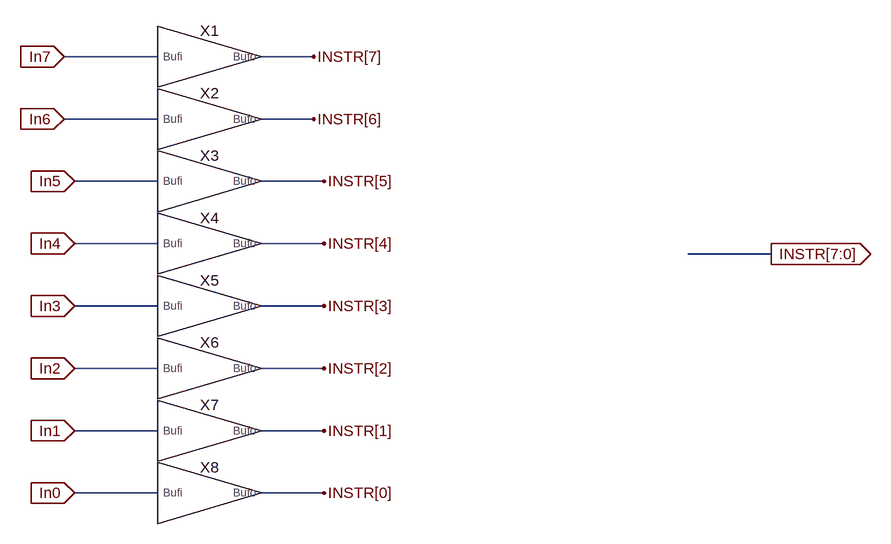
[diagram p0: schematic Combine8.asc]
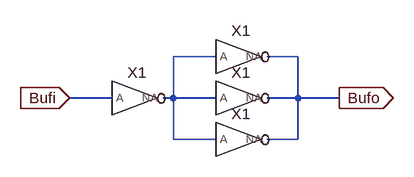
[diagram p1: sub-circuit buffer.asc]
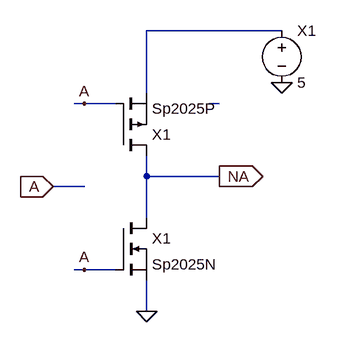
[diagram p2: sub-circuit invert.asc]
Combine8.asc, the LTspice schematic file:
Version 4.1.1
SHEET 1 1152 872
WIRE 16 128 -128 128
WIRE 256 128 176 128
WIRE 16 224 -128 224
WIRE 256 224 176 224
WIRE 16 320 -112 320
WIRE 272 320 176 320
WIRE 16 416 -112 416
WIRE 272 416 176 416
WIRE 960 432 832 432
WIRE 16 512 -112 512
WIRE 272 512 176 512
WIRE 16 608 -112 608
WIRE 272 608 176 608
WIRE 16 704 -112 704
WIRE 272 704 176 704
WIRE 16 800 -112 800
WIRE 272 800 176 800
FLAG 960 432 INSTR[7:0]
IOPIN 960 432 Out
FLAG 256 128 INSTR[7]
FLAG 256 224 INSTR[6]
FLAG 272 320 INSTR[5]
FLAG 272 416 INSTR[4]
FLAG 272 512 INSTR[3]
FLAG 272 608 INSTR[2]
FLAG 272 704 INSTR[1]
FLAG 272 800 INSTR[0]
FLAG -128 128 In7
IOPIN -128 128 In
FLAG -128 224 In6
IOPIN -128 224 In
FLAG -112 320 In5
IOPIN -112 320 In
FLAG -112 416 In4
IOPIN -112 416 In
FLAG -112 512 In3
IOPIN -112 512 In
FLAG -112 608 In2
IOPIN -112 608 In
FLAG -112 704 In1
IOPIN -112 704 In
FLAG -112 800 In0
IOPIN -112 800 In
SYMBOL Buffer 96 128 R0
SYMATTR InstName X1
SYMBOL Buffer 96 224 R0
SYMATTR InstName X2
SYMBOL Buffer 96 320 R0
SYMATTR InstName X3
SYMBOL Buffer 96 416 R0
SYMATTR InstName X4
SYMBOL Buffer 96 512 R0
SYMATTR InstName X5
SYMBOL Buffer 96 608 R0
SYMATTR InstName X6
SYMBOL Buffer 96 704 R0
SYMATTR InstName X7
SYMBOL Buffer 96 800 R0
SYMATTR InstName X8

buffer.asc, the sub-circuit schematic file:
Version 4
SHEET 1 880 680
WIRE 224 64 160 64
WIRE 352 64 304 64
WIRE 64 128 0 128
WIRE 160 128 160 64
WIRE 160 128 144 128
WIRE 224 128 160 128
WIRE 352 128 352 64
WIRE 352 128 304 128
WIRE 416 128 352 128
WIRE 160 192 160 128
WIRE 224 192 160 192
WIRE 352 192 352 128
WIRE 352 192 304 192
FLAG 0 128 Bufi
IOPIN 0 128 In
FLAG 416 128 Bufo
IOPIN 416 128 Out
SYMBOL INVERT 96 128 R0
SYMATTR InstName X1
SYMBOL INVERT 256 64 R0
SYMATTR InstName X1
SYMBOL INVERT 256 128 R0
SYMATTR InstName X1
SYMBOL INVERT 256 192 R0
SYMATTR InstName X1

invert.asc, the sub-circuit schematic file:
Version 4
SHEET 1 880 680
WIRE 352 -80 144 -80
WIRE 144 16 144 -80
WIRE 48 32 32 32
WIRE 96 32 48 32
WIRE 256 32 240 32
WIRE 144 144 144 112
WIRE 256 144 144 144
WIRE 48 160 0 160
WIRE 144 208 144 144
WIRE 48 288 32 288
WIRE 96 288 48 288
WIRE 144 352 144 304
FLAG 144 352 0
FLAG 0 160 A
IOPIN 0 160 In
FLAG 48 288 A
FLAG 48 32 A
FLAG 256 144 NA
IOPIN 256 144 Out
FLAG 352 0 0
SYMBOL pmos 96 112 M180
SYMATTR InstName X1
SYMATTR Value Sp2025P
SYMBOL nmos 96 208 R0
SYMATTR InstName X1
SYMATTR Value Sp2025N
SYMBOL voltage 352 -96 R0
SYMATTR InstName X1
SYMATTR Value 5

The netlist it stands for:
* Combine8.asc
XX1 In7 INSTR[7] buffer
XX2 In6 INSTR[6] buffer
XX3 In5 INSTR[5] buffer
XX4 In4 INSTR[4] buffer
XX5 In3 INSTR[3] buffer
XX6 In2 INSTR[2] buffer
XX7 In1 INSTR[1] buffer
XX8 In0 INSTR[0] buffer

* block symbol definitions
.subckt buffer Bufi Bufo
XX1 Bufi N001 invert
XX1 N001 Bufo invert
XX1 N001 Bufo invert
XX1 N001 Bufo invert
.ends buffer

.subckt invert A NA
M§X1 NA A N001 N001 Sp2025P
M§X1 NA A 0 0 Sp2025N
V§X1 N001 0 5
.ends invert

.model NMOS NMOS
.model PMOS PMOS
.lib standard.mos
.backanno
.end